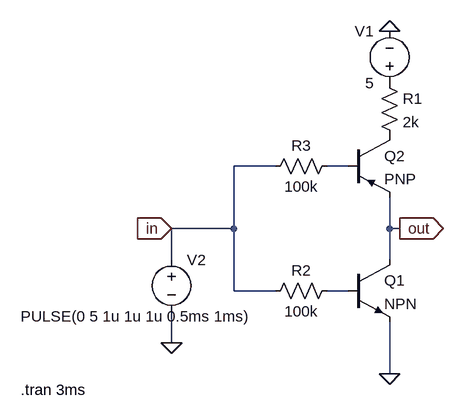
[diagram p0: schematic TTL equivalente - negación.asc]
TTL equivalente - negación.asc, the LTspice schematic file:
Version 4
SHEET 1 880 680
WIRE -64 64 -128 64
WIRE 48 64 16 64
WIRE -128 160 -128 64
WIRE -128 160 -224 160
WIRE 112 160 112 112
WIRE 128 160 112 160
WIRE -224 208 -224 160
WIRE 112 208 112 160
WIRE -128 256 -128 160
WIRE -64 256 -128 256
WIRE 48 256 16 256
WIRE -224 336 -224 288
WIRE 112 384 112 304
FLAG 112 384 0
FLAG 128 160 out
IOPIN 128 160 Out
FLAG 112 -144 0
FLAG -224 336 0
FLAG -224 160 in
IOPIN -224 160 In
SYMBOL voltage 112 -48 R180
WINDOW 0 24 96 Left 2
WINDOW 3 24 16 Left 2
WINDOW 123 0 0 Left 0
WINDOW 39 0 0 Left 0
SYMATTR InstName V1
SYMATTR Value 5
SYMBOL npn 48 208 R0
SYMATTR InstName Q1
SYMBOL res 96 -80 R0
SYMATTR InstName R1
SYMATTR Value 2k
SYMBOL res 32 240 R90
WINDOW 0 0 56 VBottom 2
WINDOW 3 32 56 VTop 2
SYMATTR InstName R2
SYMATTR Value 100k
SYMBOL pnp 48 16 R0
SYMATTR InstName Q2
SYMBOL res 32 48 R90
WINDOW 0 0 56 VBottom 2
WINDOW 3 32 56 VTop 2
SYMATTR InstName R3
SYMATTR Value 100k
SYMBOL voltage -224 192 R0
WINDOW 3 -232 103 Left 2
WINDOW 123 0 0 Left 0
WINDOW 39 0 0 Left 0
SYMATTR InstName V2
SYMATTR Value PULSE(0 5 1u 1u 1u 0.5ms 1ms)
TEXT -456 408 Left 2 !.tran 3ms

The netlist it stands for:
* TTL equivalente - negación.asc
V1 P001 0 5
Q1 out N002 0 0 NPN
R1 P001 P002 2k
R2 N002 in 100k
Q2 P002 N001 out 0 PNP
R3 N001 in 100k
V2 in 0 PULSE(0 5 1u 1u 1u 0.5ms 1ms)
.model NPN NPN
.model PNP PNP
.lib standard.bjt
.tran 3ms
.backanno
.end